# EAGLE schematic microzed_breakout_v0.6 (EAGLE 7.0.0)

## Sheet 1 of 3
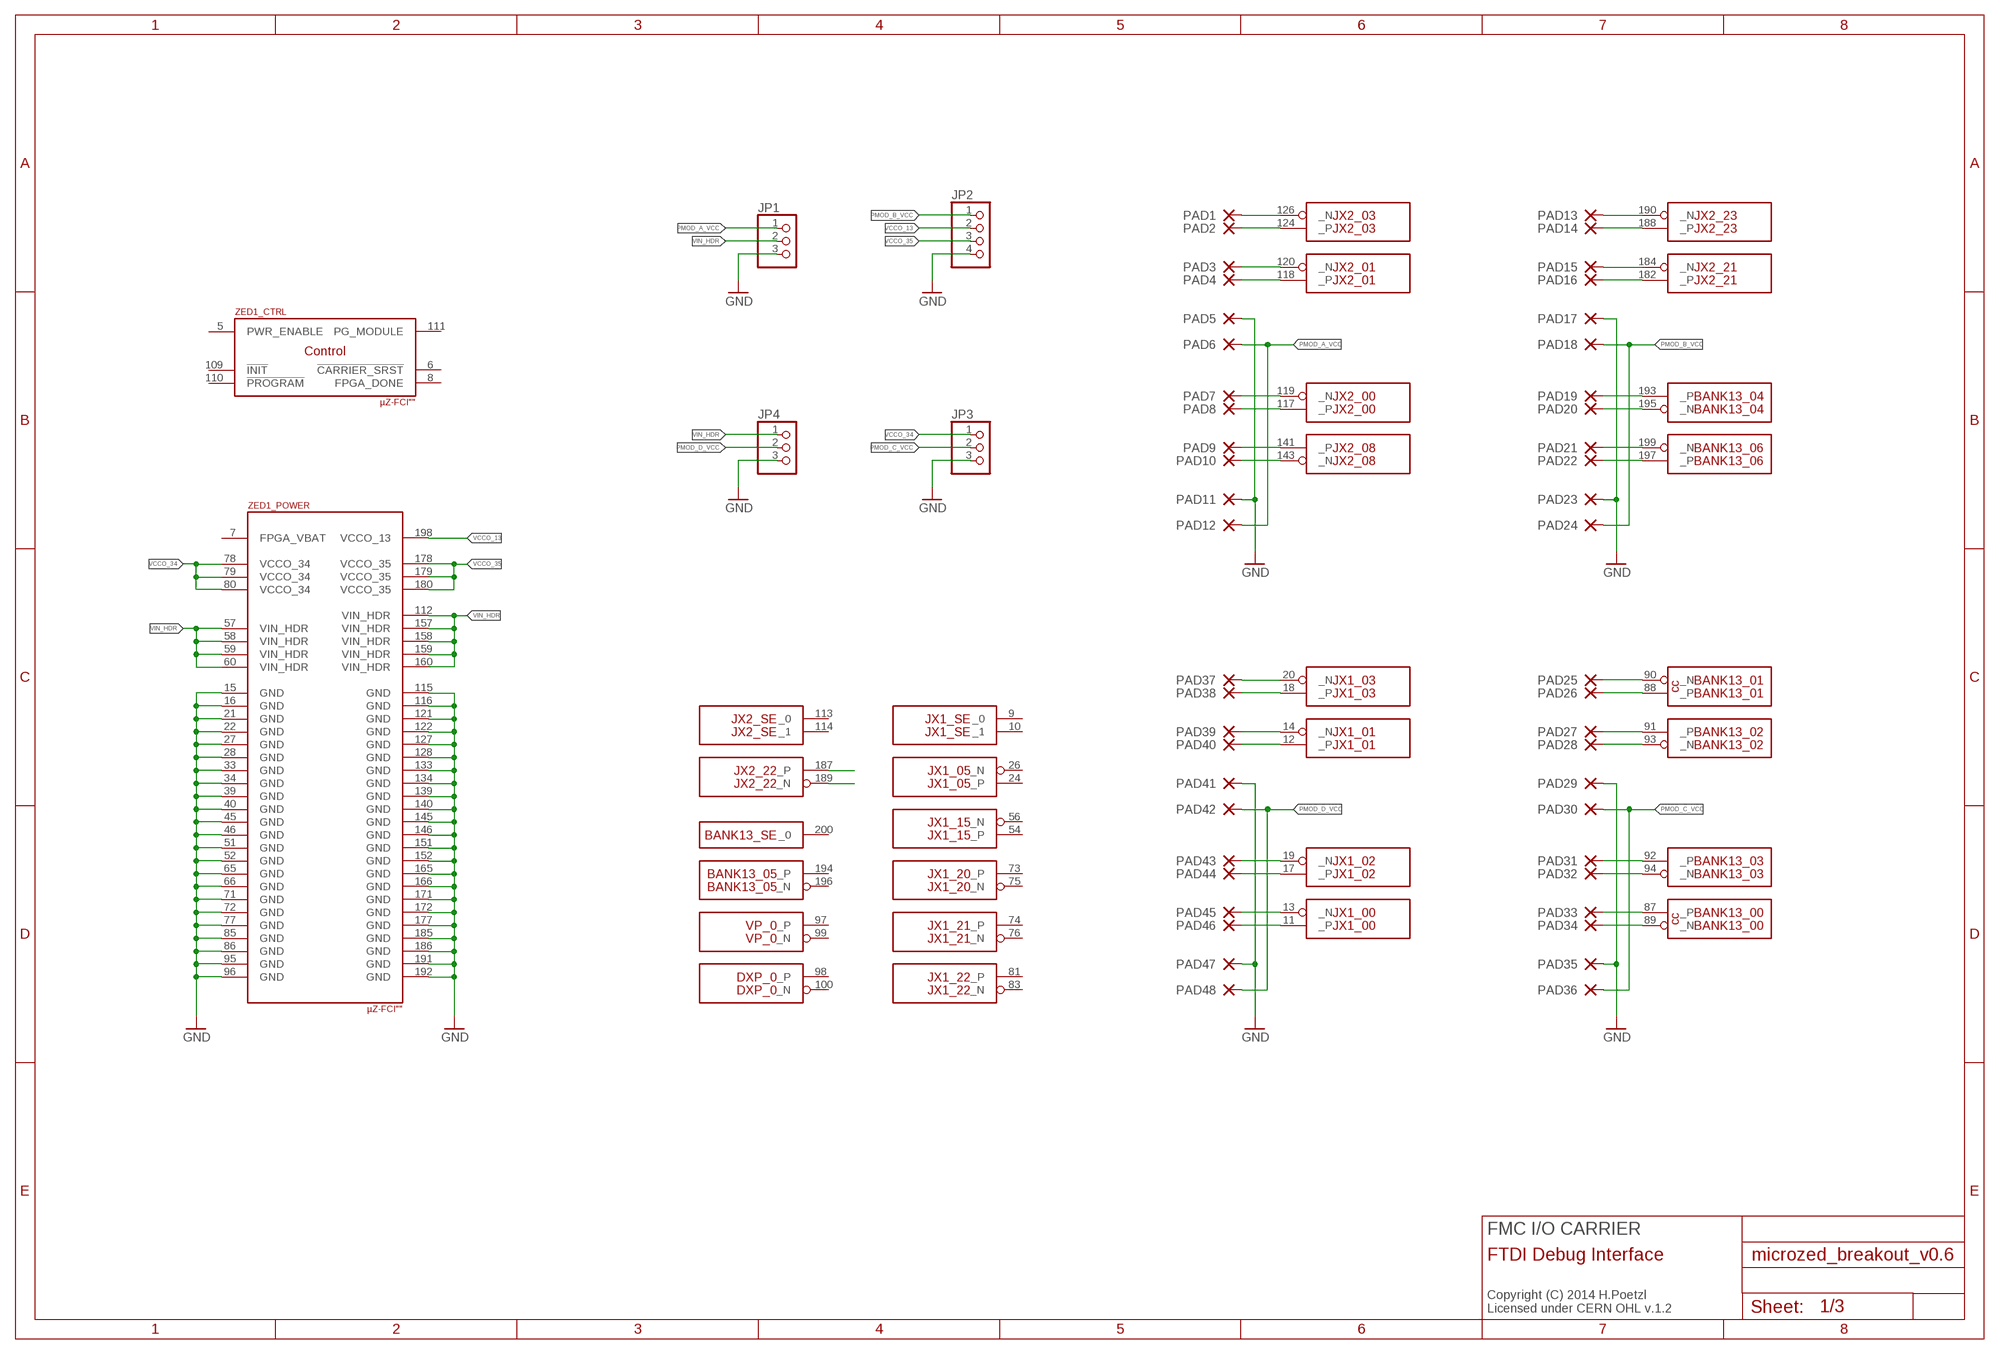
[diagram p0: schematic, sheet 1]

### Parts
JP1  PINHD-1X03_2.54  [1X03]
JP2  PINHD-1X04_2.54  [1X04]
JP3  PINHD-1X03_2.54  [1X03]
JP4  PINHD-1X03_2.54  [1X03]
PAD1  SMD-PAD1.6X3.8MM-U  [1.6X3.8U-MM]
PAD2  SMD-PAD1.6X3.8MM-U  [1.6X3.8U-MM]
PAD3  SMD-PAD1.6X3.8MM-U  [1.6X3.8U-MM]
PAD4  SMD-PAD1.6X3.8MM-U  [1.6X3.8U-MM]
PAD5  SMD-PAD1.6X3.8MM-U  [1.6X3.8U-MM]
PAD6  SMD-PAD1.6X3.8MM-U  [1.6X3.8U-MM]
PAD7  SMD-PAD1.6X3.8MM-U  [1.6X3.8U-MM]
PAD8  SMD-PAD1.6X3.8MM-U  [1.6X3.8U-MM]
PAD9  SMD-PAD1.6X3.8MM-U  [1.6X3.8U-MM]
PAD10  SMD-PAD1.6X3.8MM-U  [1.6X3.8U-MM]
PAD11  SMD-PAD1.6X3.8MM-U  [1.6X3.8U-MM]
PAD12  SMD-PAD1.6X3.8MM-U  [1.6X3.8U-MM]
PAD13  SMD-PAD1.6X3.8MM-U  [1.6X3.8U-MM]
PAD14  SMD-PAD1.6X3.8MM-U  [1.6X3.8U-MM]
PAD15  SMD-PAD1.6X3.8MM-U  [1.6X3.8U-MM]
PAD16  SMD-PAD1.6X3.8MM-U  [1.6X3.8U-MM]
PAD17  SMD-PAD1.6X3.8MM-U  [1.6X3.8U-MM]
PAD18  SMD-PAD1.6X3.8MM-U  [1.6X3.8U-MM]
PAD19  SMD-PAD1.6X3.8MM-U  [1.6X3.8U-MM]
PAD20  SMD-PAD1.6X3.8MM-U  [1.6X3.8U-MM]
PAD21  SMD-PAD1.6X3.8MM-U  [1.6X3.8U-MM]
PAD22  SMD-PAD1.6X3.8MM-U  [1.6X3.8U-MM]
PAD23  SMD-PAD1.6X3.8MM-U  [1.6X3.8U-MM]
PAD24  SMD-PAD1.6X3.8MM-U  [1.6X3.8U-MM]
PAD25  SMD-PAD1.6X3.8MM-U  [1.6X3.8U-MM]
PAD26  SMD-PAD1.6X3.8MM-U  [1.6X3.8U-MM]
PAD27  SMD-PAD1.6X3.8MM-U  [1.6X3.8U-MM]
PAD28  SMD-PAD1.6X3.8MM-U  [1.6X3.8U-MM]
PAD29  SMD-PAD1.6X3.8MM-U  [1.6X3.8U-MM]
PAD30  SMD-PAD1.6X3.8MM-U  [1.6X3.8U-MM]
PAD31  SMD-PAD1.6X3.8MM-U  [1.6X3.8U-MM]
PAD32  SMD-PAD1.6X3.8MM-U  [1.6X3.8U-MM]
PAD33  SMD-PAD1.6X3.8MM-U  [1.6X3.8U-MM]
PAD34  SMD-PAD1.6X3.8MM-U  [1.6X3.8U-MM]
PAD35  SMD-PAD1.6X3.8MM-U  [1.6X3.8U-MM]
PAD36  SMD-PAD1.6X3.8MM-U  [1.6X3.8U-MM]
PAD37  SMD-PAD1.6X3.8MM-U  [1.6X3.8U-MM]
PAD38  SMD-PAD1.6X3.8MM-U  [1.6X3.8U-MM]
PAD39  SMD-PAD1.6X3.8MM-U  [1.6X3.8U-MM]
PAD40  SMD-PAD1.6X3.8MM-U  [1.6X3.8U-MM]
PAD41  SMD-PAD1.6X3.8MM-U  [1.6X3.8U-MM]
PAD42  SMD-PAD1.6X3.8MM-U  [1.6X3.8U-MM]
PAD43  SMD-PAD1.6X3.8MM-U  [1.6X3.8U-MM]
PAD44  SMD-PAD1.6X3.8MM-U  [1.6X3.8U-MM]
PAD45  SMD-PAD1.6X3.8MM-U  [1.6X3.8U-MM]
PAD46  SMD-PAD1.6X3.8MM-U  [1.6X3.8U-MM]
PAD47  SMD-PAD1.6X3.8MM-U  [1.6X3.8U-MM]
PAD48  SMD-PAD1.6X3.8MM-U  [1.6X3.8U-MM]
ZED1  µZ-FCI""  [µZ]

### Nets
BANK13_00_N [LVDS]: PAD34.1(P) ZED1.89(BANK13_00:_N)
BANK13_00_P [LVDS]: PAD33.1(P) ZED1.87(BANK13_00:_P)
BANK13_01_N [LVDS]: PAD25.1(P) ZED1.90(BANK13_01:_N)
BANK13_01_P [LVDS]: PAD26.1(P) ZED1.88(BANK13_01:_P)
BANK13_02_N [LVDS]: PAD28.1(P) ZED1.93(BANK13_02:_N)
BANK13_02_P [LVDS]: PAD27.1(P) ZED1.91(BANK13_02:_P)
BANK13_03_N [LVDS]: PAD32.1(P) ZED1.94(BANK13_03:_N)
BANK13_03_P [LVDS]: PAD31.1(P) ZED1.92(BANK13_03:_P)
BANK13_04_N [LVDS]: PAD20.1(P) ZED1.195(BANK13_04:_N)
BANK13_04_P [LVDS]: PAD19.1(P) ZED1.193(BANK13_04:_P)
BANK13_06_N [LVDS]: PAD21.1(P) ZED1.199(BANK13_06:_N)
BANK13_06_P [LVDS]: PAD22.1(P) ZED1.197(BANK13_06:_P)
GND: JP1.3 JP2.4 JP3.3 JP4.3 PAD5.1(P) PAD11.1(P) PAD17.1(P) PAD23.1(P) PAD29.1(P) PAD35.1(P) PAD41.1(P) PAD47.1(P) ZED1.15(_POWER:GND) ZED1.16(_POWER:GND) ZED1.21(_POWER:GND) ZED1.22(_POWER:GND) ZED1.27(_POWER:GND) ZED1.28(_POWER:GND) ZED1.33(_POWER:GND) ZED1.34(_POWER:GND) ZED1.39(_POWER:GND) ZED1.40(_POWER:GND) ZED1.45(_POWER:GND) ZED1.46(_POWER:GND) ZED1.51(_POWER:GND) ZED1.52(_POWER:GND) ZED1.65(_POWER:GND) ZED1.66(_POWER:GND) ZED1.71(_POWER:GND) ZED1.72(_POWER:GND) ZED1.77(_POWER:GND) ZED1.85(_POWER:GND) ZED1.86(_POWER:GND) ZED1.95(_POWER:GND) ZED1.96(_POWER:GND) ZED1.115(_POWER:GND) ZED1.116(_POWER:GND) ZED1.121(_POWER:GND) ZED1.122(_POWER:GND) ZED1.127(_POWER:GND) ZED1.128(_POWER:GND) ZED1.133(_POWER:GND) ZED1.134(_POWER:GND) ZED1.139(_POWER:GND) ZED1.140(_POWER:GND) ZED1.145(_POWER:GND) ZED1.146(_POWER:GND) ZED1.151(_POWER:GND) ZED1.152(_POWER:GND) ZED1.165(_POWER:GND) ZED1.166(_POWER:GND) ZED1.171(_POWER:GND) ZED1.172(_POWER:GND) ZED1.177(_POWER:GND) ZED1.185(_POWER:GND) ZED1.186(_POWER:GND) ZED1.191(_POWER:GND) ZED1.192(_POWER:GND) ; also sheet 2,3
JX1_00_N [LVDS]: PAD45.1(P) ZED1.13(JX1_00:_N)
JX1_00_P [LVDS]: PAD46.1(P) ZED1.11(JX1_00:_P)
JX1_01_N [LVDS]: PAD39.1(P) ZED1.14(JX1_01:_N)
JX1_01_P [LVDS]: PAD40.1(P) ZED1.12(JX1_01:_P)
JX1_02_N [LVDS]: PAD43.1(P) ZED1.19(JX1_02:_N)
JX1_02_P [LVDS]: PAD44.1(P) ZED1.17(JX1_02:_P)
JX1_03_N [LVDS]: PAD37.1(P) ZED1.20(JX1_03:_N)
JX1_03_P [LVDS]: PAD38.1(P) ZED1.18(JX1_03:_P)
JX2_00_N [LVDS]: PAD7.1(P) ZED1.119(JX2_00:_N)
JX2_00_P [LVDS]: PAD8.1(P) ZED1.117(JX2_00:_P)
JX2_01_N [LVDS]: PAD3.1(P) ZED1.120(JX2_01:_N)
JX2_01_P [LVDS]: PAD4.1(P) ZED1.118(JX2_01:_P)
JX2_03_N [LVDS]: PAD1.1(P) ZED1.126(JX2_03:_N)
JX2_03_P [LVDS]: PAD2.1(P) ZED1.124(JX2_03:_P)
JX2_08_N [LVDS]: PAD10.1(P) ZED1.143(JX2_08:_N)
JX2_08_P [LVDS]: PAD9.1(P) ZED1.141(JX2_08:_P)
JX2_21_N [LVDS]: PAD15.1(P) ZED1.184(JX2_21:_N)
JX2_21_P [LVDS]: PAD16.1(P) ZED1.182(JX2_21:_P)
JX2_23_N [LVDS]: PAD13.1(P) ZED1.190(JX2_23:_N)
JX2_23_P [LVDS]: PAD14.1(P) ZED1.188(JX2_23:_P)
N$1: ZED1.187(JX2_22:_P)
N$3: ZED1.189(JX2_22:_N)
PMOD_A_VCC [LVDS]: JP1.1 PAD6.1(P) PAD12.1(P)
PMOD_B_VCC [LVDS]: JP2.1 PAD18.1(P) PAD24.1(P)
PMOD_C_VCC [LVDS]: JP3.2 PAD30.1(P) PAD36.1(P)
PMOD_D_VCC [LVDS]: JP4.2 PAD42.1(P) PAD48.1(P)
VCCO_13 [LVDS]: JP2.2 ZED1.198(_POWER:VCCO_13)
VCCO_34: JP3.1 ZED1.78(_POWER:VCCO_34) ZED1.79(_POWER:VCCO_34) ZED1.80(_POWER:VCCO_34)
VCCO_35: JP2.3 ZED1.178(_POWER:VCCO_35) ZED1.179(_POWER:VCCO_35) ZED1.180(_POWER:VCCO_35)
VIN_HDR [LVDS]: JP1.2 JP4.1 ZED1.57(_POWER:VIN_HDR) ZED1.58(_POWER:VIN_HDR) ZED1.59(_POWER:VIN_HDR) ZED1.60(_POWER:VIN_HDR) ZED1.112(_POWER:VIN_HDR) ZED1.157(_POWER:VIN_HDR) ZED1.158(_POWER:VIN_HDR) ZED1.159(_POWER:VIN_HDR) ZED1.160(_POWER:VIN_HDR)
Unconnected: ZED1.5(_CTRL:PWR_ENABLE) ZED1.6(_CTRL:!CARRIER_SRST) ZED1.8(_CTRL:FPGA_DONE) ZED1.9(JX1_SE:_0) ZED1.10(JX1_SE:_1) ZED1.24(JX1_05:_P) ZED1.26(JX1_05:_N) ZED1.54(JX1_15:_P) ZED1.56(JX1_15:_N) ZED1.73(JX1_20:_P) ZED1.74(JX1_21:_P) ZED1.75(JX1_20:_N) ZED1.76(JX1_21:_N) ZED1.81(JX1_22:_P) ZED1.83(JX1_22:_N) ZED1.97(VP_0:_P) ZED1.98(DXP_0:_P) ZED1.99(VP_0:_N) ZED1.100(DXP_0:_N) ZED1.101(_PMOD:PMOD_D0) ZED1.102(_PMOD:PMOD_D1) ZED1.103(_PMOD:PMOD_D2) ZED1.104(_PMOD:PMOD_D3) ZED1.105(_PMOD:PMOD_D4) ZED1.106(_PMOD:PMOD_D5) ZED1.107(_PMOD:PMOD_D6) ZED1.108(_PMOD:PMOD_D7) ZED1.109(_CTRL:!INIT) ZED1.110(_CTRL:!PROGRAM) ZED1.111(_CTRL:PG_MODULE) ZED1.113(JX2_SE:_0) ZED1.114(JX2_SE:_1) ZED1.194(BANK13_05:_P) ZED1.196(BANK13_05:_N) ZED1.200(BANK13_SE:_0)

### Notes on the sheet
- FMC I/O CARRIER
- FTDI Debug Interface
- Copyright (C) 2014 H.Poetzl
  Licensed under CERN OHL v.1.2

## Sheet 2 of 3
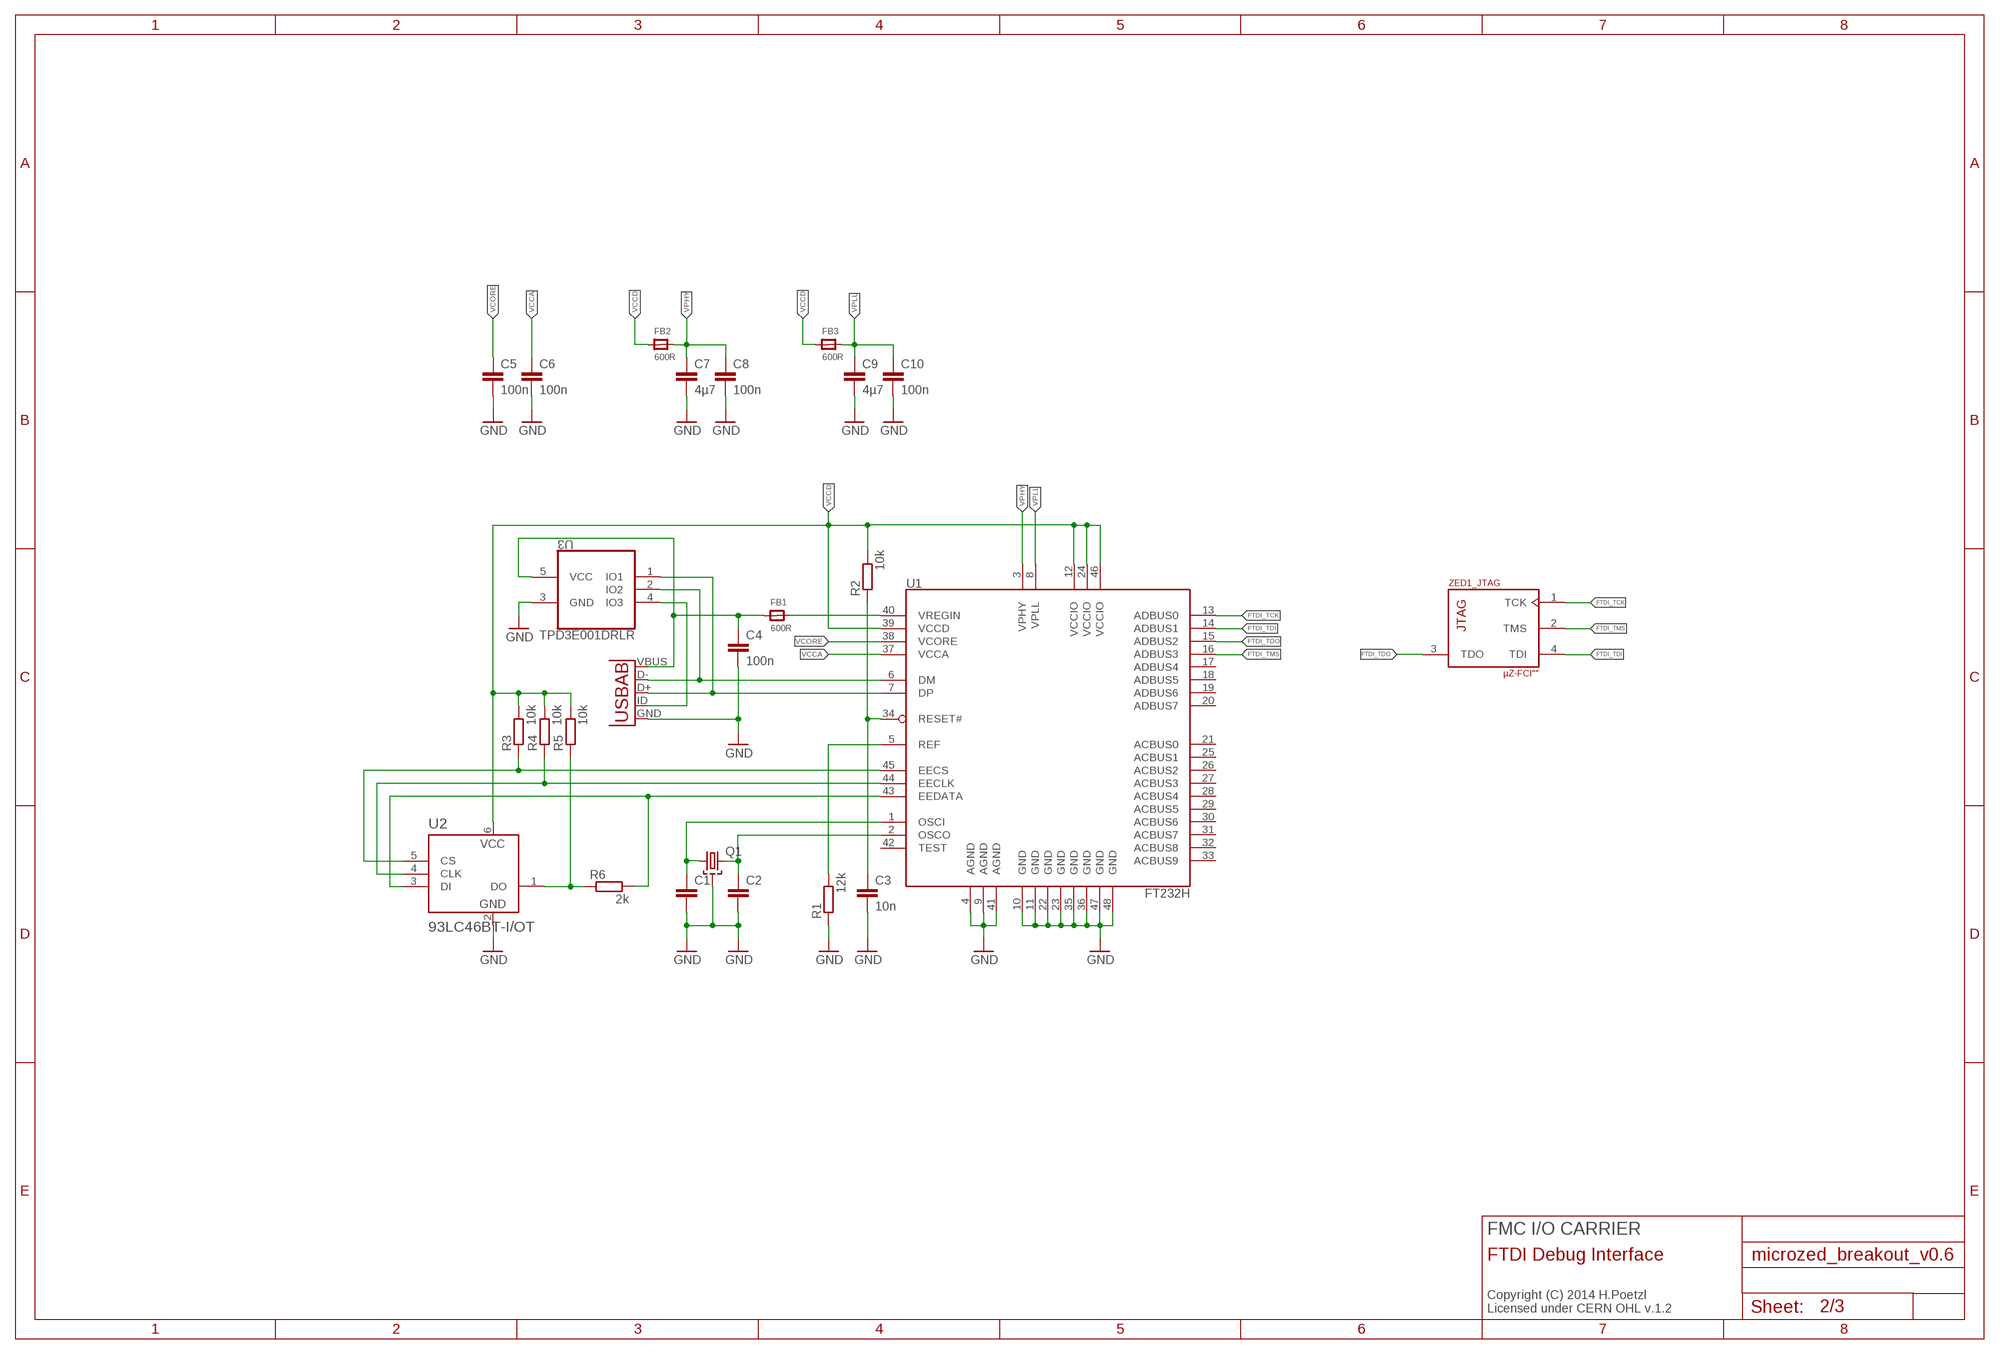
[diagram p1: schematic, sheet 2]

### Parts
C1  C-EUC0402K  [C0402K]
C2  C-EUC0402K  [C0402K]
C3  10n  C-EUC0402K  [C0402K]
C4  100n  C-EUC0402K  [C0402K]
C5  100n  C-EUC0402K  [C0402K]
C6  100n  C-EUC0402K  [C0402K]
C7  4µ7  C-EUC0402K  [C0402K]
C8  100n  C-EUC0402K  [C0402K]
C9  4µ7  C-EUC0402K  [C0402K]
C10  100n  C-EUC0402K  [C0402K]
FB1  600R  FERRITE_0603MP  [_0603MP]
FB2  600R  FERRITE_0603MP  [_0603MP]
FB3  600R  FERRITE_0603MP  [_0603MP]
Q1  SMD-4P-2G-3.2X2.5  [ABM8G]
R1  12k  R-EU_R0402  [R0402]
R2  10k  R-EU_R0402  [R0402]
R3  10k  R-EU_R0402  [R0402]
R4  10k  R-EU_R0402  [R0402]
R5  10k  R-EU_R0402  [R0402]
R6  2k  R-EU_R0402  [R0402]
U1  FT232H  [LQFP48]
U2  93LC46BT-I/OT  [SOT95P280X145-6N]
U3  TPD3E001DRLR  [SOT50P160X60-5N]
USB  USB-AB  [USB-AB-MICRO-SMD]

### Nets
EE_CLK1: R4.1 U1.44(EECLK) U2.4(CLK)
EE_CS1: R3.1 U1.45(EECS) U2.5(CS)
EE_DATA1: R6.2 U1.43(EEDATA) U2.3(DI)
FTDI_D+: U1.7(DP) U3.1(IO1) USB.D+
FTDI_D-: U1.6(DM) U3.2(IO2) USB.D-
FTDI_TCK: U1.13(ADBUS0) ZED1.1(_JTAG:TCK)
FTDI_TDI: U1.14(ADBUS1) ZED1.4(_JTAG:TDI)
FTDI_TDO: U1.15(ADBUS2) ZED1.3(_JTAG:TDO)
FTDI_TMS: U1.16(ADBUS3) ZED1.2(_JTAG:TMS)
GND: C1.2 C2.2 C3.2 C4.2 C5.2 C6.2 C7.2 C8.2 C9.2 C10.2 Q1.2(GND) Q1.4(GND) R1.1 U1.4(AGND) U1.9(AGND) U1.10(GND) U1.11(GND) U1.22(GND) U1.23(GND) U1.35(GND) U1.36(GND) U1.41(AGND) U1.47(GND) U1.48(GND) U2.2(VSS) U3.3(GND) USB.GND ; also sheet 1,3
N$177: R5.1 R6.1 U2.1(DO)
N$178: C1.1 Q1.1 U1.1(OSCI)
N$179: C2.1 Q1.3 U1.2(OSCO)
N$180: C3.1 R2.1 U1.34(RESET#)
N$181: R1.2 U1.5(REF)
N$182: U3.4(IO3) USB.ID(USBID)
VBUS: C4.1 FB1.1 U3.5(VCC) USB.VBUS
VCCA: C6.1 U1.37(VCCA)
VCCD: FB2.1 FB3.1 R2.2 R3.2 R4.2 R5.2 U1.12(VCCIO) U1.24(VCCIO) U1.39(VCCD) U1.46(VCCIO) U2.6(VCC)
VCORE: C5.1 U1.38(VCORE)
VPHY: C7.1 C8.1 FB2.2 U1.3(VPHY)
VPLL: C9.1 C10.1 FB3.2 U1.8(VPLL)
VREGIN: FB1.2 U1.40(VREGIN)
Unconnected: U1.17(ADBUS4) U1.18(ADBUS5) U1.19(ADBUS6) U1.20(ADBUS7) U1.21(ACBUS0) U1.25(ACBUS1) U1.26(ACBUS2) U1.27(ACBUS3) U1.28(ACBUS4) U1.29(ACBUS5) U1.30(ACBUS6) U1.31(ACBUS7) U1.32(ACBUS8) U1.33(ACBUS9) U1.42(TEST)

### Notes on the sheet
- FMC I/O CARRIER
- FTDI Debug Interface
- Copyright (C) 2014 H.Poetzl
  Licensed under CERN OHL v.1.2

## Sheet 3 of 3
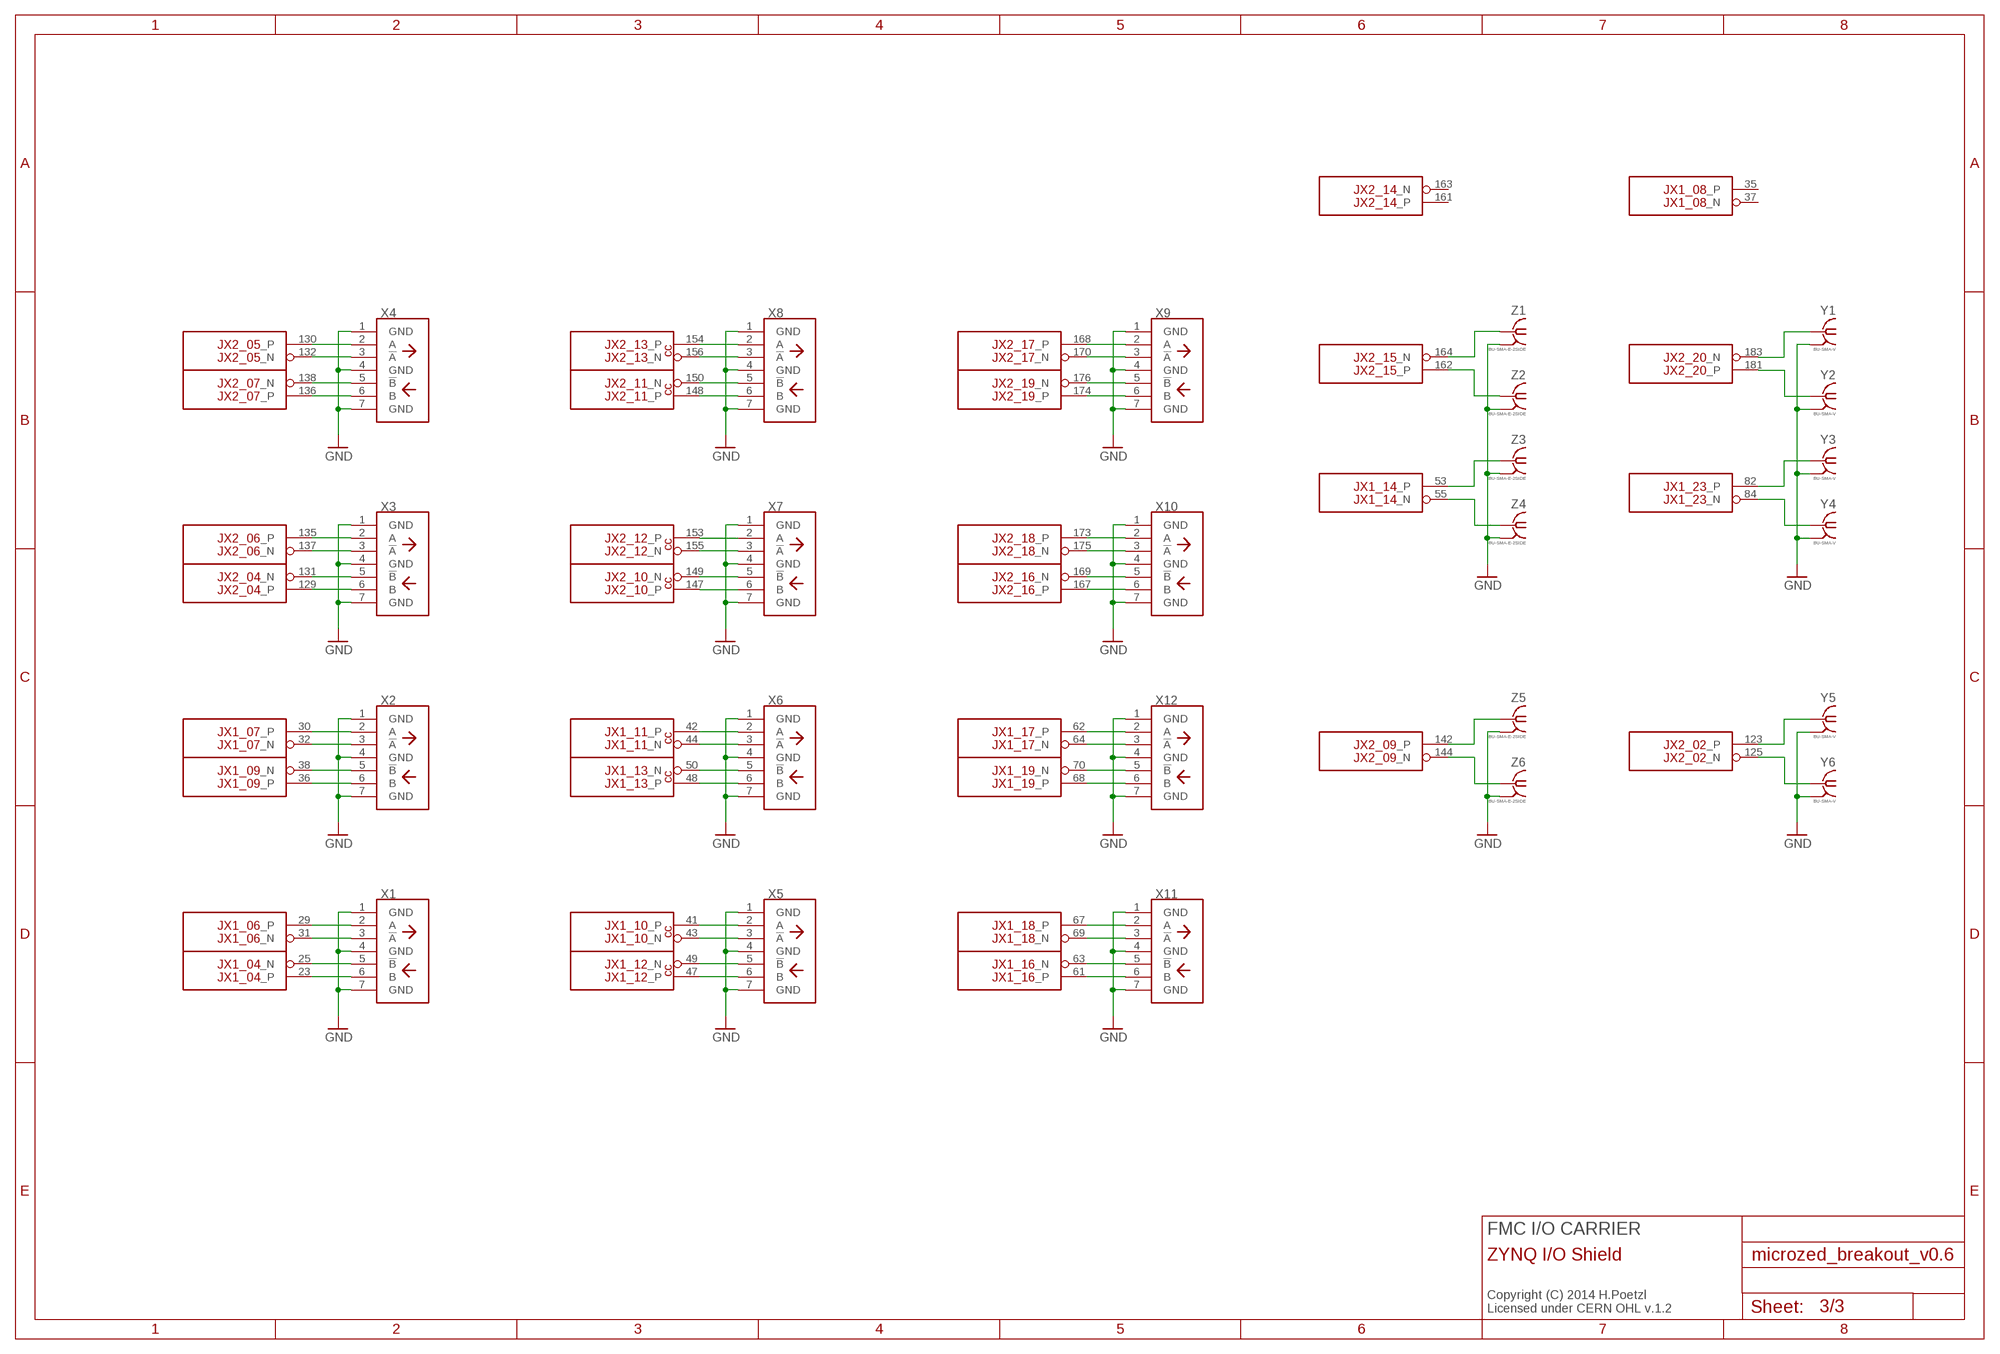
[diagram p2: schematic, sheet 3]

### Parts
X1  SATA7-SMD-VERT  [SATA7-SMD-VERT]
X2  SATA7-VERT  [SATA7-VERT]
X3  SATA7-VERT  [SATA7-VERT]
X4  SATA7-SMD-VERT  [SATA7-SMD-VERT]
X5  SATA7-SMD-VERT  [SATA7-SMD-VERT]
X6  SATA7-VERT  [SATA7-VERT]
X7  SATA7-VERT  [SATA7-VERT]
X8  SATA7-SMD-VERT  [SATA7-SMD-VERT]
X9  SATA7-SMD-VERT  [SATA7-SMD-VERT]
X10  SATA7-VERT  [SATA7-VERT]
X11  SATA7-SMD-VERT  [SATA7-SMD-VERT]
X12  SATA7-VERT  [SATA7-VERT]
Y1  BU-SMA-V  [BU-SMA-V]
Y2  BU-SMA-V  [BU-SMA-V]
Y3  BU-SMA-V  [BU-SMA-V]
Y4  BU-SMA-V  [BU-SMA-V]
Y5  BU-SMA-V  [BU-SMA-V]
Y6  BU-SMA-V  [BU-SMA-V]
Z1  BU-SMA-E-2SIDE  [SMA_EDGE_2SIDE]
Z2  BU-SMA-E-2SIDE  [SMA_EDGE_2SIDE]
Z3  BU-SMA-E-2SIDE  [SMA_EDGE_2SIDE]
Z4  BU-SMA-E-2SIDE  [SMA_EDGE_2SIDE]
Z5  BU-SMA-E-2SIDE  [SMA_EDGE_2SIDE]
Z6  BU-SMA-E-2SIDE  [SMA_EDGE_2SIDE]

### Nets
GND: X1.1(GND) X1.4(GND) X1.7(GND) X2.1(GND) X2.4(GND) X2.7(GND) X3.1(GND) X3.4(GND) X3.7(GND) X4.1(GND) X4.4(GND) X4.7(GND) X5.1(GND) X5.4(GND) X5.7(GND) X6.1(GND) X6.4(GND) X6.7(GND) X7.1(GND) X7.4(GND) X7.7(GND) X8.1(GND) X8.4(GND) X8.7(GND) X9.1(GND) X9.4(GND) X9.7(GND) X10.1(GND) X10.4(GND) X10.7(GND) X11.1(GND) X11.4(GND) X11.7(GND) X12.1(GND) X12.4(GND) X12.7(GND) Y1.2 Y1.3 Y1.4 Y1.5 Y2.2 Y2.3 Y2.4 Y2.5 Y3.2 Y3.3 Y3.4 Y3.5 Y4.2 Y4.3 Y4.4 Y4.5 Y5.2 Y5.3 Y5.4 Y5.5 Y6.2 Y6.3 Y6.4 Y6.5 Z1.2@1 Z1.2@2 Z1.2@3 Z1.2@4 Z2.2@1 Z2.2@2 Z2.2@3 Z2.2@4 Z3.2@1 Z3.2@2 Z3.2@3 Z3.2@4 Z4.2@1 Z4.2@2 Z4.2@3 Z4.2@4 Z5.2@1 Z5.2@2 Z5.2@3 Z5.2@4 Z6.2@1 Z6.2@2 Z6.2@3 Z6.2@4 ; also sheet 1,2
JX1_04_N [LVDS]: X1.5(!B) ZED1.25(JX1_04:_N)
JX1_04_P [LVDS]: X1.6(B) ZED1.23(JX1_04:_P)
JX1_06_N [LVDS]: X1.3(!A) ZED1.31(JX1_06:_N)
JX1_06_P [LVDS]: X1.2(A) ZED1.29(JX1_06:_P)
JX1_07_N [LVDS]: X2.3(!A) ZED1.32(JX1_07:_N)
JX1_07_P [LVDS]: X2.2(A) ZED1.30(JX1_07:_P)
JX1_09_N [LVDS]: X2.5(!B) ZED1.38(JX1_09:_N)
JX1_09_P [LVDS]: X2.6(B) ZED1.36(JX1_09:_P)
JX1_10_N [LVDS]: X5.3(!A) ZED1.43(JX1_10:_N)
JX1_10_P [LVDS]: X5.2(A) ZED1.41(JX1_10:_P)
JX1_11_N [LVDS]: X6.3(!A) ZED1.44(JX1_11:_N)
JX1_11_P [LVDS]: X6.2(A) ZED1.42(JX1_11:_P)
JX1_12_N [LVDS]: X5.5(!B) ZED1.49(JX1_12:_N)
JX1_12_P [LVDS]: X5.6(B) ZED1.47(JX1_12:_P)
JX1_13_N [LVDS]: X6.5(!B) ZED1.50(JX1_13:_N)
JX1_13_P [LVDS]: X6.6(B) ZED1.48(JX1_13:_P)
JX1_14_N [LVDS]: Z4.1 ZED1.55(JX1_14:_N)
JX1_14_P [LVDS]: Z3.1 ZED1.53(JX1_14:_P)
JX1_16_N [LVDS]: X11.5(!B) ZED1.63(JX1_16:_N)
JX1_16_P [LVDS]: X11.6(B) ZED1.61(JX1_16:_P)
JX1_17_N [LVDS]: X12.3(!A) ZED1.64(JX1_17:_N)
JX1_17_P [LVDS]: X12.2(A) ZED1.62(JX1_17:_P)
JX1_18_N [LVDS]: X11.3(!A) ZED1.69(JX1_18:_N)
JX1_18_P [LVDS]: X11.2(A) ZED1.67(JX1_18:_P)
JX1_19_N [LVDS]: X12.5(!B) ZED1.70(JX1_19:_N)
JX1_19_P [LVDS]: X12.6(B) ZED1.68(JX1_19:_P)
JX1_23_N [LVDS]: Y4.1 ZED1.84(JX1_23:_N)
JX1_23_P [LVDS]: Y3.1 ZED1.82(JX1_23:_P)
JX2_02_N [LVDS]: Y6.1 ZED1.125(JX2_02:_N)
JX2_02_P [LVDS]: Y5.1 ZED1.123(JX2_02:_P)
JX2_04_N [LVDS]: X3.5(!B) ZED1.131(JX2_04:_N)
JX2_04_P [LVDS]: X3.6(B) ZED1.129(JX2_04:_P)
JX2_05_N [LVDS]: X4.3(!A) ZED1.132(JX2_05:_N)
JX2_05_P [LVDS]: X4.2(A) ZED1.130(JX2_05:_P)
JX2_06_N [LVDS]: X3.3(!A) ZED1.137(JX2_06:_N)
JX2_06_P [LVDS]: X3.2(A) ZED1.135(JX2_06:_P)
JX2_07_N [LVDS]: X4.5(!B) ZED1.138(JX2_07:_N)
JX2_07_P [LVDS]: X4.6(B) ZED1.136(JX2_07:_P)
JX2_09_N [LVDS]: Z6.1 ZED1.144(JX2_09:_N)
JX2_09_P [LVDS]: Z5.1 ZED1.142(JX2_09:_P)
JX2_10_N [LVDS]: X7.5(!B) ZED1.149(JX2_10:_N)
JX2_10_P [LVDS]: X7.6(B) ZED1.147(JX2_10:_P)
JX2_11_N [LVDS]: X8.5(!B) ZED1.150(JX2_11:_N)
JX2_11_P [LVDS]: X8.6(B) ZED1.148(JX2_11:_P)
JX2_12_N [LVDS]: X7.3(!A) ZED1.155(JX2_12:_N)
JX2_12_P [LVDS]: X7.2(A) ZED1.153(JX2_12:_P)
JX2_13_N [LVDS]: X8.3(!A) ZED1.156(JX2_13:_N)
JX2_13_P [LVDS]: X8.2(A) ZED1.154(JX2_13:_P)
JX2_15_N [LVDS]: Z1.1 ZED1.164(JX2_15:_N)
JX2_15_P [LVDS]: Z2.1 ZED1.162(JX2_15:_P)
JX2_16_N [LVDS]: X10.5(!B) ZED1.169(JX2_16:_N)
JX2_16_P [LVDS]: X10.6(B) ZED1.167(JX2_16:_P)
JX2_17_N [LVDS]: X9.3(!A) ZED1.170(JX2_17:_N)
JX2_17_P [LVDS]: X9.2(A) ZED1.168(JX2_17:_P)
JX2_18_N [LVDS]: X10.3(!A) ZED1.175(JX2_18:_N)
JX2_18_P [LVDS]: X10.2(A) ZED1.173(JX2_18:_P)
JX2_19_N [LVDS]: X9.5(!B) ZED1.176(JX2_19:_N)
JX2_19_P [LVDS]: X9.6(B) ZED1.174(JX2_19:_P)
JX2_20_N [LVDS]: Y1.1 ZED1.183(JX2_20:_N)
JX2_20_P [LVDS]: Y2.1 ZED1.181(JX2_20:_P)
Unconnected: ZED1.35(JX1_08:_P) ZED1.37(JX1_08:_N) ZED1.161(JX2_14:_P) ZED1.163(JX2_14:_N)

### Notes on the sheet
- FMC I/O CARRIER
- ZYNQ I/O Shield
- Copyright (C) 2014 H.Poetzl
  Licensed under CERN OHL v.1.2

## Power pins joined to a net without a drawn wire
FPGA_VBAT: ZED1.7(_POWER:FPGA_VBAT)

## Library data of the parts
C1-C10 = rcl:C-EU: CAPACITOR, European symbol
FB1-FB3 = microbuilder:FERRITE: Ferrite Bead 0603 MMZ1608B121C - 120 Ohm @ 100MHz, 600mA, 0.15 Ohm DC Resistance - Digikey: 445-2164-1-ND BK1608HW121-T - 120 Ohm, 600mA Ferrite Chip - Digikey: 587-1876-2-ND 0805 HZ0805B272R-10 - 2.7K Ohm @ 100MHz, 200mA, 0.8 Ohm DC Resistance - Digikey: 240-2504-1-ND (see also Murata BLM21BD272SN1L) MMZ2012Y152B - 1.5K Ohm @ 100MHz, 500mA, 0.4 Ohm DC Resistance - Digikey: 445-1560-1-ND - Mainly for high frequency (80-400MHz) MMZ2012R102A - 1K Ohm @ 100MHz, 500mA, 0.3 Ohm DC Resistance - Digikey: 445-1555-2-ND - More general purpose (10-200MHz)
JP1 JP3 JP4 = pinhead-2:PINHD-1X03: PIN HEADER
JP2 = pinhead-2:PINHD-1X04: PIN HEADER
PAD1-PAD48 = smd_pads:SMD-PAD: SMD PAD
Q1 = xtal:SMD-4P-2G
R1-R6 = rcl:R-EU_: RESISTOR, European symbol
U1 = ft232h:FT232H: FTDI FT232H DS: http://www.ftdichip.com/Support/Documents/DataSheets/ICs/DS_FT232H.pdf
U2 = 93lc46:93LC46BT-I/OT: 1K Microwire Compatible Serial EEPROM; MPN: 93LC46BT-I/OT; OC_FARNELL: 1556164; OC_NEWARK: 75M3689; PACKAGE: SOT-6; SUPPLIER: Microchip
U3 = esd:TPD3E001DRLR: LOW-CAPACITANCE 3-CHANNEL ±15-kV ESD-PROTECTION ARRAY FOR HIGH-SPEED DATA INTERFACES; MPN: TPD3E001DRLR; OC_FARNELL: 1603422; OC_NEWARK: 41M5842; PACKAGE: SOT-5; SUPPLIER: Texas Instruments
USB = SparkFun-Connectors:USB-AB: This is a USB AB connector that is compatible with USB OTG. i.e. this connector can serve as a host or device
X1-X12 = sata:SATA7: SATA 7-pin connector From host perspective, A is transmit and B is receive.
Y1-Y6 = sma:BU-SMA-V: FEMALE SMA CONNECTOR Radiall distributor RS 112-3794; OC_FARNELL: unknown; OC_NEWARK: unknown
Z1-Z6 = sma:BU-SMA-E
ZED1 = microzed:µZ-FCI

## Net classes
0 default: width 0.152 mm, drill 0.254 mm, clearance 0.152 mm
1 LVDS: width 0.152 mm, drill 0.254 mm, clearance 0.152 mm